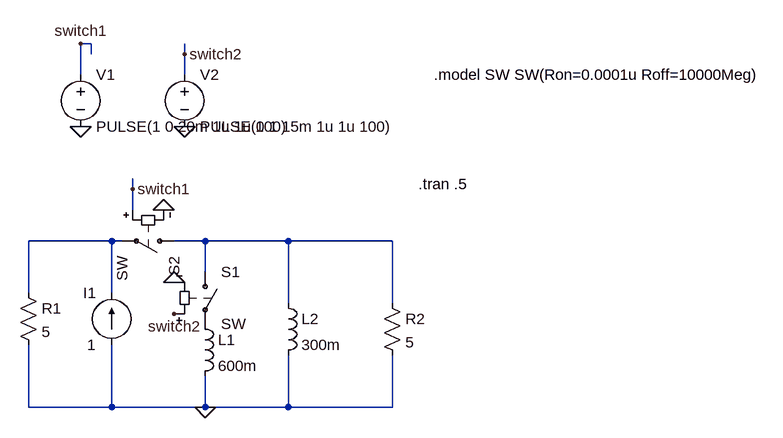
[diagram p0: schematic Draft2.asc]
Draft2.asc, the LTspice schematic file:
Version 4.1
SHEET 1 1216 680
WIRE 144 -272 128 -272
WIRE 144 -256 144 -272
WIRE 288 -256 288 -272
WIRE 128 -224 128 -272
WIRE 288 -224 288 -256
WIRE 208 -48 208 -64
WIRE 208 -16 208 -48
WIRE 176 32 48 32
WIRE 192 32 176 32
WIRE 320 32 272 32
WIRE 448 32 320 32
WIRE 608 32 448 32
WIRE 320 80 320 32
WIRE 48 112 48 32
WIRE 176 112 176 32
WIRE 448 128 448 32
WIRE 608 128 608 32
WIRE 48 288 48 192
WIRE 176 288 176 192
WIRE 176 288 48 288
WIRE 320 288 320 240
WIRE 320 288 176 288
WIRE 448 288 448 208
WIRE 448 288 320 288
WIRE 608 288 608 208
WIRE 608 288 448 288
FLAG 128 -144 0
FLAG 288 -144 0
FLAG 288 -256 switch2
FLAG 272 144 switch2
FLAG 128 -272 switch1
FLAG 272 96 0
FLAG 320 288 0
FLAG 208 -48 switch1
FLAG 256 -16 0
SYMBOL res 32 96 R0
SYMATTR InstName R1
SYMATTR Value 5
SYMBOL res 592 112 R0
SYMATTR InstName R2
SYMATTR Value 5
SYMBOL ind 304 144 R0
SYMATTR InstName L1
SYMATTR Value 600m
SYMATTR SpiceLine Rser=0
SYMBOL ind 432 112 R0
SYMATTR InstName L2
SYMATTR Value 300m
SYMATTR SpiceLine Rser=0
SYMBOL current 176 192 R180
WINDOW 0 24 80 Left 2
WINDOW 3 24 0 Left 2
SYMATTR InstName I1
SYMATTR Value 1
SYMBOL sw 320 64 R0
SYMATTR InstName S1
SYMBOL sw 288 32 R90
SYMATTR InstName S2
SYMBOL voltage 128 -240 R0
WINDOW 123 0 0 Left 0
WINDOW 39 0 0 Left 0
SYMATTR InstName V1
SYMATTR Value PULSE(1 0 20m 1u 1u 100)
SYMBOL voltage 288 -240 R0
WINDOW 123 0 0 Left 0
WINDOW 39 0 0 Left 0
SYMATTR InstName V2
SYMATTR Value PULSE(0 1 15m 1u 1u 100)
TEXT 672 -224 Left 2 !.model SW SW(Ron=0.0001u Roff=10000Meg)
TEXT 648 -56 Left 2 !.tran .5

The netlist it stands for:
* Draft2.asc
R1 N001 0 5
R2 N002 0 5
L1 P001 0 600m Rser=0
L2 N002 0 300m Rser=0
I1 0 N001 1
S1 N002 P001 switch2 0 SW
S2 N002 N001 switch1 0 SW
V1 switch1 0 PULSE(1 0 20m 1u 1u 100)
V2 switch2 0 PULSE(0 1 15m 1u 1u 100)
.model SW SW(Ron=0.0001u Roff=10000Meg)
.tran .5
.backanno
.end